# Altium schematic sheet Napajanje_2.SchDoc
size A4
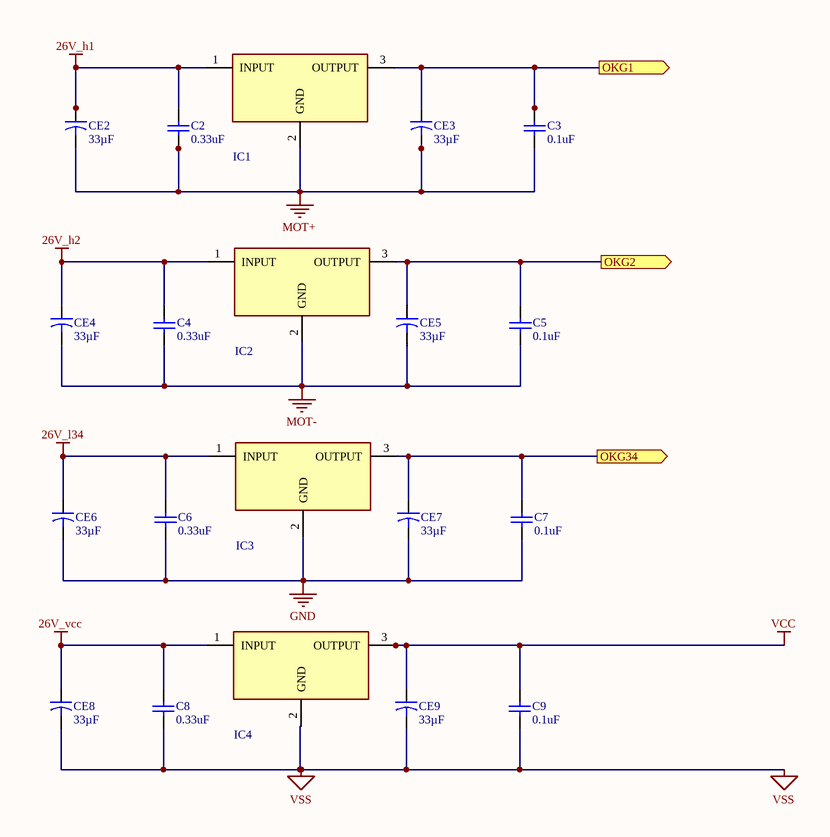
[diagram p0: Napajanje_2.SchDoc]

## Parts
C2  value 0.33uF  [CAP3, 0.33uF, 50V]  (hidden comment: 1C20Z5U334M050B-ND)
C3  value 0.1uF  [CAP4, 0.1uF, 50V]  (hidden comment: BC1160TR-ND)
C4  value 0.33uF  [CAP3, 0.33uF, 50V]  (hidden comment: 1C20Z5U334M050B-ND)
C5  value 0.1uF  [CAP4, 0.1uF, 50V]  (hidden comment: BC1160TR-ND)
C6  value 0.33uF  [CAP3, 0.33uF, 50V]  (hidden comment: 1C20Z5U334M050B-ND)
C7  value 0.1uF  [CAP4, 0.1uF, 50V]  (hidden comment: BC1160TR-ND)
C8  value 0.33uF  [CAP3, 0.33uF, 50V]  (hidden comment: 1C20Z5U334M050B-ND)
C9  value 0.1uF  [CAP4, 0.1uF, 50V]  (hidden comment: BC1160TR-ND)
CE2  value 33µF  [CAP1 33uF, 35V]  (hidden comment: 399-6575-ND)
CE3  value 33µF  [CAP1 33uF, 35V]  (hidden comment: 399-6575-ND)
CE4  value 33µF  [CAP1 33uF, 35V]  (hidden comment: 399-6575-ND)
CE5  value 33µF  [CAP1 33uF, 35V]  (hidden comment: 399-6575-ND)
CE6  value 33µF  [CAP1 33uF, 35V]  (hidden comment: 399-6575-ND)
CE7  value 33µF  [CAP1 33uF, 35V]  (hidden comment: 399-6575-ND)
CE8  value 33µF  [CAP1 33uF, 35V]  (hidden comment: 399-6575-ND)
CE9  value 33µF  [CAP1 33uF, 35V]  (hidden comment: 399-6575-ND)
IC1  512-LM7812ACT  [LM7812ACT, 1A]  (value not drawn)
IC2  512-LM7812ACT  [LM7812ACT, 1A]  (value not drawn)
IC3  512-LM7812ACT  [LM7812ACT, 1A]  (value not drawn)
IC4  LM7805ACT  [LM7805ACT, 1A]  (value not drawn)

## Ports
OKG1 (out), OKG2 (out), OKG34 (out)

## Nets
26V_h1: C2.2 CE2.1 IC1.1(INPUT)
26V_h2: C4.2 CE4.1 IC2.1(INPUT)
26V_l34: C6.2 CE6.1 IC3.1(INPUT)
26V_vcc: C8.2 CE8.1 IC4.1(INPUT)
GND: C6.1 C7.1 CE6.2 CE7.2 IC3.2(GND)
MOT+: C2.1 C3.1 CE2.2 CE3.2 IC1.2(GND)
MOT-: C4.1 C5.1 CE4.2 CE5.2 IC2.2(GND)
VCC: C9.2 CE9.1 IC4.3(OUTPUT)
VSS: C8.1 C9.1 CE8.2 CE9.2 IC4.2(GND)
OKG1: C3.2 CE3.1 IC1.3(OUTPUT) ; port OKG1
OKG2: C5.2 CE5.1 IC2.3(OUTPUT) ; port OKG2
OKG34: C7.2 CE7.1 IC3.3(OUTPUT) ; port OKG34

## Library data of the parts
C2 C4 C6 C8 = Cap3: CER 0.33uF, 50V; Manufacturer: Vishay BC Components; Digi-Key Part Number: 1C20Z5U334M050B-ND; Datasheet Link: https://media.digikey.com/pdf/Data%20Sheets/BC%20Components%20PDFs/1C-9C_Series_Rev_Sep_2015.pdf; Manufacturer Part Number: 1C20Z5U334M050B
C3 C5 C7 C9 = Cap4: CER 0.1uF, 50V; Manufacturer: Vishay BC Components; Manufacturer Part Number: K104Z15Y5VF5TL2; Detailed Description: 0.1µF -20%, +80% 50V Ceramic Capacitor Y5V (F) Radial; Digi-Key Part Number: BC1160TR-ND; Datasheet: http://www.vishay.com/docs/45171/kseries.pdf
CE2-CE9 = Cap1: ALU 33uF, 35V; Manufacturer: KEMET; Manufacturer Part Number: ESH336M035AC3AA; Detailed Description: 33µF 35V Aluminum Electrolytic Capacitors Radial, Can  2000 Hrs @ 105°C; Digi-Key Part Number: 399-6575-ND; Datasheet: https://content.kemet.com/datasheets/KEM_A4005_ESH.pdf
IC1-IC3 = IC2: LM7812ACT, 1A; Manufacturer_Name: ON Semiconductor; Datasheet Link: https://componentsearchengine.com/Datasheets/2/LM7805ACT.pdf; Manufacturer_Part_Number: LM7812ACT; Mouser Part Number: 512-LM7812ACT; Mouser Price/Stock: https://www.mouser.com/Search/Refine.aspx?Keyword=512-LM7805ACT; RS Part Number: 8062839; RS Price/Stock: http://uk.rs-online.com/web/p/products/8062839
IC4 = IC1: LM7805ACT, 1A; Manufacturer_Name: ON Semiconductor; Datasheet Link: https://componentsearchengine.com/Datasheets/2/LM7805ACT.pdf; Height: 4.7mm; Manufacturer_Part_Number: LM7805ACT; Mouser Part Number: 512-LM7805ACT; Mouser Price/Stock: https://www.mouser.com/Search/Refine.aspx?Keyword=512-LM7805ACT; RS Part Number: 8062839; RS Price/Stock: http://uk.rs-online.com/web/p/products/8062839